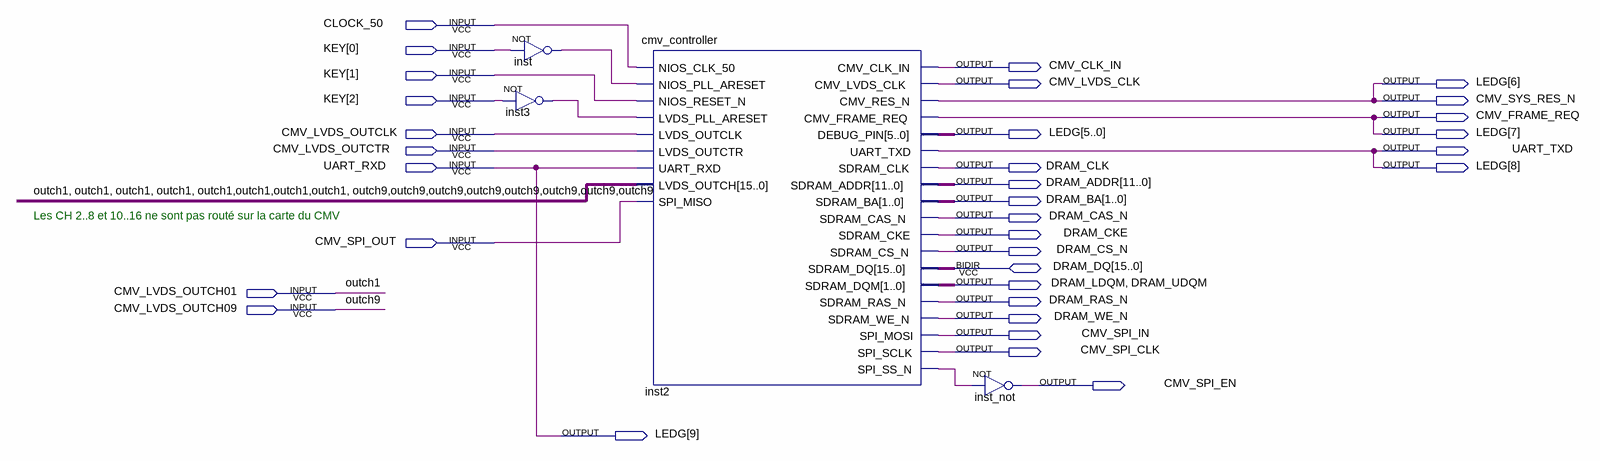
[diagram p0: schematic sheet]
// Quartus schematic de0_cyclone3.bdf as structural Verilog: 4 symbols, 33 pins
module de0_cyclone3 (
  input  CLOCK_50,
  input  [2:0] KEY,
  input  CMV_LVDS_OUTCLK,
  input  CMV_LVDS_OUTCTR,
  input  UART_RXD,
  input  CMV_SPI_OUT,
  input  CMV_LVDS_OUTCH01,
  input  CMV_LVDS_OUTCH09,
  inout  [15:0] DRAM_DQ,
  output CMV_CLK_IN,
  output CMV_LVDS_CLK,
  output [9:0] LEDG,
  output CMV_SYS_RES_N,
  output CMV_FRAME_REQ,
  output UART_TXD,
  output DRAM_CLK,
  output [11:0] DRAM_ADDR,
  output [1:0] DRAM_BA,
  output DRAM_CAS_N,
  output DRAM_CKE,
  output DRAM_CS_N,
  output DRAM_LDQM,
  output DRAM_UDQM,
  output DRAM_RAS_N,
  output DRAM_WE_N,
  output CMV_SPI_IN,
  output CMV_SPI_CLK,
  output CMV_SPI_EN
);

  wire inst2_spi_ss_n, inst3_out, inst_out;

  not inst (inst_out, KEY[0]);
  not inst3 (inst3_out, KEY[2]);
  cmv_controller inst2 (
    .NIOS_CLK_50(CLOCK_50), .NIOS_PLL_ARESET(inst_out), .NIOS_RESET_N(KEY[1]), .LVDS_PLL_ARESET(inst3_out),
    .LVDS_OUTCLK(CMV_LVDS_OUTCLK), .LVDS_OUTCTR(CMV_LVDS_OUTCTR), .UART_RXD(UART_RXD),
    .LVDS_OUTCH({{8{CMV_LVDS_OUTCH01}}, {8{CMV_LVDS_OUTCH09}}}), .SPI_MISO(CMV_SPI_OUT),
    .CMV_CLK_IN(CMV_CLK_IN), .CMV_LVDS_CLK(CMV_LVDS_CLK), .CMV_RES_N(CMV_SYS_RES_N),
    .CMV_FRAME_REQ(CMV_FRAME_REQ), .DEBUG_PIN(LEDG[5:0]), .UART_TXD(LEDG[8]), .SDRAM_CLK(DRAM_CLK),
    .SDRAM_ADDR(DRAM_ADDR), .SDRAM_BA(DRAM_BA), .SDRAM_CAS_N(DRAM_CAS_N), .SDRAM_CKE(DRAM_CKE),
    .SDRAM_CS_N(DRAM_CS_N), .SDRAM_DQM({DRAM_LDQM, DRAM_UDQM}), .SDRAM_RAS_N(DRAM_RAS_N),
    .SDRAM_WE_N(DRAM_WE_N), .SPI_MOSI(CMV_SPI_IN), .SPI_SCLK(CMV_SPI_CLK), .SPI_SS_N(inst2_spi_ss_n),
    .SDRAM_DQ(DRAM_DQ));
  not inst_not (CMV_SPI_EN, inst2_spi_ss_n);

  assign {LEDG[9], LEDG[7:6]} = {UART_RXD, CMV_FRAME_REQ, CMV_SYS_RES_N};
  assign UART_TXD = LEDG[8];

  // Other names for the same wires on the sheet: outch1 = CMV_LVDS_OUTCH01; outch9 = CMV_LVDS_OUTCH09

  // Notes on the sheet:
  //   Les CH 2..8 et 10..16 ne sont pas routé sur la carte du CMV
endmodule
